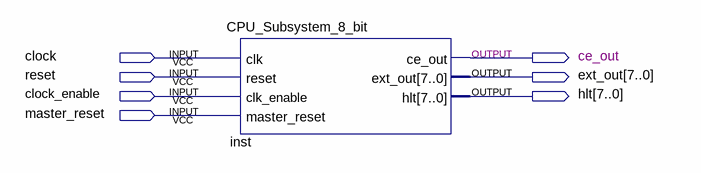
[diagram p0: schematic sheet]
// Quartus schematic CPU_Subsystem_8_bit_SCM.bdf as structural Verilog: 1 symbols, 7 pins
module CPU_Subsystem_8_bit_SCM (
  input  clock,
  input  reset,
  input  clock_enable,
  input  master_reset,
  output ce_out,
  output [7:0] ext_out,
  output [7:0] hlt
);

  CPU_Subsystem_8_bit inst (
    .clk(clock), .reset(reset), .clk_enable(clock_enable), .master_reset(master_reset), .ce_out(ce_out),
    .ext_out(ext_out), .hlt(hlt));
endmodule
